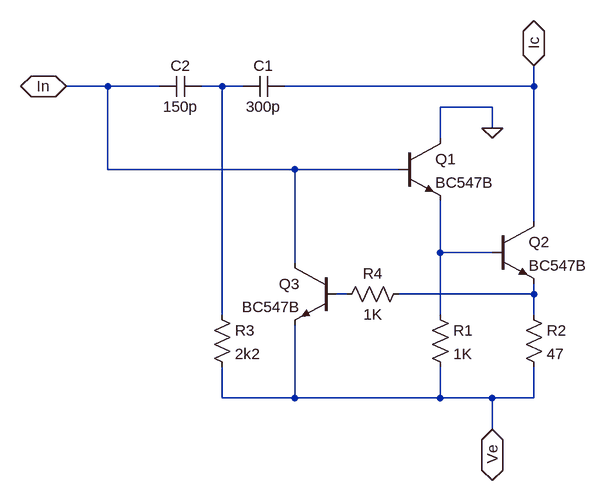
[diagram p0: schematic voltage_amplifier.asc]
voltage_amplifier.asc, the LTspice schematic file:
Version 4
SHEET 1 880 680
WIRE -288 48 -352 48
WIRE -208 48 -288 48
WIRE -112 48 -144 48
WIRE -80 48 -112 48
WIRE 368 48 368 16
WIRE 368 48 -16 48
WIRE 304 80 224 80
WIRE 304 112 304 80
WIRE 224 128 224 80
WIRE -288 176 -288 48
WIRE 0 176 -288 176
WIRE 160 176 0 176
WIRE 368 256 368 48
WIRE 224 304 224 224
WIRE 304 304 224 304
WIRE 0 320 0 176
WIRE 80 368 64 368
WIRE 368 368 368 352
WIRE 368 368 160 368
WIRE -112 400 -112 48
WIRE 224 400 224 304
WIRE 368 400 368 368
WIRE -112 528 -112 480
WIRE 0 528 0 416
WIRE 0 528 -112 528
WIRE 224 528 224 480
WIRE 224 528 0 528
WIRE 304 528 224 528
WIRE 368 528 368 480
WIRE 368 528 304 528
WIRE 304 576 304 528
FLAG 304 576 Ve
IOPIN 304 576 BiDir
FLAG 304 112 0
FLAG 368 16 Ic
IOPIN 368 16 BiDir
FLAG -352 48 In
IOPIN -352 48 BiDir
SYMBOL npn 160 128 R0
SYMATTR InstName Q1
SYMATTR Value BC547B
SYMBOL npn 304 256 R0
SYMATTR InstName Q2
SYMATTR Value BC547B
SYMBOL res 208 384 R0
SYMATTR InstName R1
SYMATTR Value 1K
SYMBOL res 352 384 R0
SYMATTR InstName R2
SYMATTR Value 47
SYMBOL cap -16 32 R90
WINDOW 0 0 32 VBottom 2
WINDOW 3 32 32 VTop 2
SYMATTR InstName C1
SYMATTR Value 300p
SYMBOL cap -144 32 R90
WINDOW 0 0 32 VBottom 2
WINDOW 3 32 32 VTop 2
SYMATTR InstName C2
SYMATTR Value 150p
SYMBOL res -128 384 R0
SYMATTR InstName R3
SYMATTR Value 2k2
SYMBOL res 176 352 R90
WINDOW 0 0 56 VBottom 2
WINDOW 3 32 56 VTop 2
SYMATTR InstName R4
SYMATTR Value 1K
SYMBOL npn 64 320 M0
SYMATTR InstName Q3
SYMATTR Value BC547B

The netlist it stands for:
* voltage_amplifier.asc
Q1 0 In N002 0 BC547B
Q2 Ic N002 N004 0 BC547B
R1 N002 Ve 1K
R2 N004 Ve 47
C1 Ic N001 300p
C2 N001 In 150p
R3 N001 Ve 2k2
R4 N004 N003 1K
Q3 In N003 Ve 0 BC547B
.model NPN NPN
.model PNP PNP
.lib standard.bjt
.backanno
.end